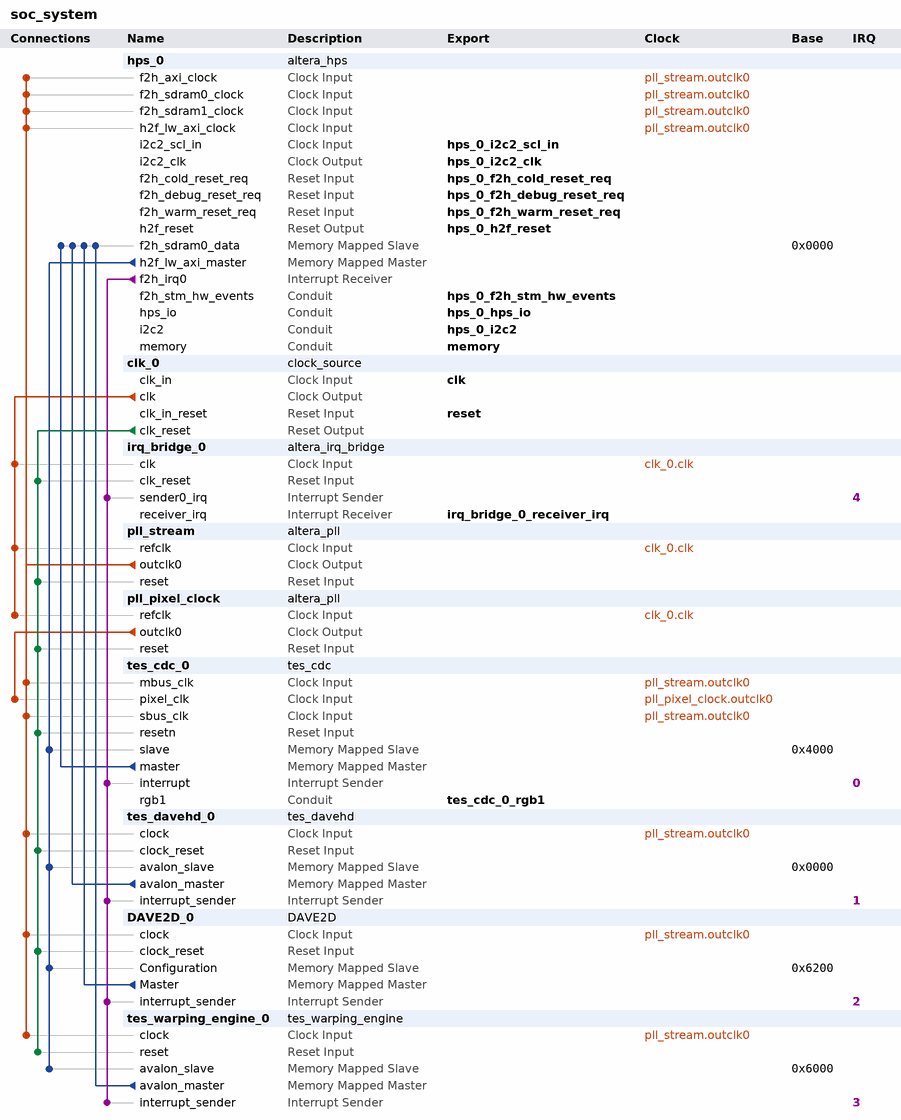
[diagram p0: system contents]
# Platform Designer (Qsys) system soc_system, Cyclone V 5CSXFC6C6U23C6
# Parameters at their usual value, and those the tool derives, are not listed.
package require -exact qsys 19.1
create_system soc_system
set_project_property DEVICE_FAMILY {Cyclone V}
set_project_property DEVICE 5CSXFC6C6U23C6

add_instance hps_0 altera_hps 19.1
set_instance_parameter_value hps_0 EMAC1_Mode RGMII
set_instance_parameter_value hps_0 EMAC1_PinMuxing {HPS I/O Set 0}
set_instance_parameter_value hps_0 F2SCLK_COLDRST_Enable true
set_instance_parameter_value hps_0 F2SCLK_DBGRST_Enable true
set_instance_parameter_value hps_0 F2SCLK_WARMRST_Enable true
set_instance_parameter_value hps_0 F2SDRAM_Type {Avalon-MM Bidirectional,Avalon-MM Bidirectional}
set_instance_parameter_value hps_0 F2SDRAM_Width 128,128
set_instance_parameter_value hps_0 F2SINTERRUPT_Enable true
set_instance_parameter_value hps_0 F2S_Width 3
set_instance_parameter_value hps_0 FPGA_PERIPHERAL_OUTPUT_CLOCK_FREQ_EMAC0_GTX_CLK 100
set_instance_parameter_value hps_0 FPGA_PERIPHERAL_OUTPUT_CLOCK_FREQ_EMAC0_MD_CLK 100.0
set_instance_parameter_value hps_0 FPGA_PERIPHERAL_OUTPUT_CLOCK_FREQ_EMAC1_GTX_CLK 100
set_instance_parameter_value hps_0 FPGA_PERIPHERAL_OUTPUT_CLOCK_FREQ_EMAC1_MD_CLK 100.0
set_instance_parameter_value hps_0 HPS_PROTOCOL DDR3
set_instance_parameter_value hps_0 I2C0_Mode I2C
set_instance_parameter_value hps_0 I2C0_PinMuxing {HPS I/O Set 0}
set_instance_parameter_value hps_0 I2C1_Mode I2C
set_instance_parameter_value hps_0 I2C1_PinMuxing {HPS I/O Set 0}
set_instance_parameter_value hps_0 I2C2_Mode Full
set_instance_parameter_value hps_0 I2C2_PinMuxing FPGA
set_instance_parameter_value hps_0 LWH2F_Enable true
set_instance_parameter_value hps_0 MEM_BANKADDR_WIDTH 3
set_instance_parameter_value hps_0 MEM_CLK_FREQ 400.0
set_instance_parameter_value hps_0 MEM_COL_ADDR_WIDTH 10
set_instance_parameter_value hps_0 MEM_DQ_WIDTH 32
set_instance_parameter_value hps_0 MEM_DRV_STR RZQ/6
set_instance_parameter_value hps_0 MEM_ROW_ADDR_WIDTH 15
set_instance_parameter_value hps_0 MEM_RTT_NOM RZQ/6
set_instance_parameter_value hps_0 MEM_RTT_WR {Dynamic ODT off}
set_instance_parameter_value hps_0 MEM_TCL 7
set_instance_parameter_value hps_0 MEM_TFAW_NS 37.5
set_instance_parameter_value hps_0 MEM_TRAS_NS 35.0
set_instance_parameter_value hps_0 MEM_TRCD_NS 13.75
set_instance_parameter_value hps_0 MEM_TRFC_NS 300.0
set_instance_parameter_value hps_0 MEM_TRP_NS 13.75
set_instance_parameter_value hps_0 MEM_VENDOR Other
set_instance_parameter_value hps_0 MEM_WTCL 7
set_instance_parameter_value hps_0 QSPI_Mode N/A
set_instance_parameter_value hps_0 QSPI_PinMuxing Unused
set_instance_parameter_value hps_0 REF_CLK_FREQ 25.0
set_instance_parameter_value hps_0 S2FCLK_USER2CLK 5
set_instance_parameter_value hps_0 S2F_Width 0
set_instance_parameter_value hps_0 SDIO_Mode {4-bit Data}
set_instance_parameter_value hps_0 SDIO_PinMuxing {HPS I/O Set 0}
set_instance_parameter_value hps_0 SPIM1_Mode {Single Slave Select}
set_instance_parameter_value hps_0 SPIM1_PinMuxing {HPS I/O Set 0}
set_instance_parameter_value hps_0 STM_Enable true
set_instance_parameter_value hps_0 TIMING_BOARD_AC_SKEW 0.02
set_instance_parameter_value hps_0 TIMING_BOARD_AC_TO_CK_SKEW 0.0
set_instance_parameter_value hps_0 TIMING_BOARD_DQ_TO_DQS_SKEW 0.0
set_instance_parameter_value hps_0 TIMING_BOARD_MAX_CK_DELAY 0.6
set_instance_parameter_value hps_0 TIMING_BOARD_MAX_DQS_DELAY 0.6
set_instance_parameter_value hps_0 TIMING_BOARD_SKEW_BETWEEN_DQS 0.02
set_instance_parameter_value hps_0 TIMING_BOARD_SKEW_CKDQS_DIMM_MAX 0.01
set_instance_parameter_value hps_0 TIMING_BOARD_SKEW_CKDQS_DIMM_MIN -0.01
set_instance_parameter_value hps_0 TIMING_BOARD_SKEW_WITHIN_DQS 0.02
set_instance_parameter_value hps_0 TIMING_TDH 125
set_instance_parameter_value hps_0 TIMING_TDQSCK 400
set_instance_parameter_value hps_0 TIMING_TDQSQ 120
set_instance_parameter_value hps_0 TIMING_TDS 50
set_instance_parameter_value hps_0 TIMING_TIH 250
set_instance_parameter_value hps_0 TIMING_TIS 175
set_instance_parameter_value hps_0 TIMING_TQSH 0.38
set_instance_parameter_value hps_0 UART0_Mode {No Flow Control}
set_instance_parameter_value hps_0 UART0_PinMuxing {HPS I/O Set 0}
set_instance_parameter_value hps_0 USB1_Mode SDR
set_instance_parameter_value hps_0 USB1_PinMuxing {HPS I/O Set 0}
set_instance_parameter_value hps_0 desired_cfg_clk_mhz 100.0
set_instance_parameter_value hps_0 desired_qspi_clk_mhz 370.0

add_instance clk_0 clock_source 19.1
set_instance_parameter_value clk_0 clockFrequency 50000000

add_instance irq_bridge_0 altera_irq_bridge 19.1
set_instance_parameter_value irq_bridge_0 IRQ_WIDTH 1

add_instance pll_stream altera_pll 19.1
set_instance_parameter_value pll_stream gui_device_speed_grade 2
set_instance_parameter_value pll_stream gui_number_of_clocks 1
set_instance_parameter_value pll_stream gui_operation_mode direct
set_instance_parameter_value pll_stream gui_output_clock_frequency0 85.0
set_instance_parameter_value pll_stream gui_pll_mode {Integer-N PLL}
set_instance_parameter_value pll_stream gui_reference_clock_frequency 50.0
set_instance_parameter_value pll_stream gui_use_locked true

add_instance pll_pixel_clock altera_pll 19.1
set_instance_parameter_value pll_pixel_clock gui_device_speed_grade 1
set_instance_parameter_value pll_pixel_clock gui_number_of_clocks 1
set_instance_parameter_value pll_pixel_clock gui_operation_mode direct
set_instance_parameter_value pll_pixel_clock gui_output_clock_frequency0 65.0
set_instance_parameter_value pll_pixel_clock gui_pll_mode {Integer-N PLL}
set_instance_parameter_value pll_pixel_clock gui_reference_clock_frequency 50.0
set_instance_parameter_value pll_pixel_clock gui_use_locked true

add_instance tes_cdc_0 tes_cdc 3.0
set_instance_parameter_value tes_cdc_0 BG_BLUE 0
set_instance_parameter_value tes_cdc_0 BG_GREEN 0
set_instance_parameter_value tes_cdc_0 BG_RED 0
set_instance_parameter_value tes_cdc_0 BLUE_WIDTH 8
set_instance_parameter_value tes_cdc_0 C_AUX_FB_FIFO_ADDRESS_WIDTH 9
set_instance_parameter_value tes_cdc_0 C_AXI_ID_ENA true
set_instance_parameter_value tes_cdc_0 C_BACKGROUND_BLENDING_ENA false
set_instance_parameter_value tes_cdc_0 C_BACKGROUND_LAYER_ENA false
set_instance_parameter_value tes_cdc_0 C_BG_COLOR_PROG true
set_instance_parameter_value tes_cdc_0 C_BG_RAM_ADDRESS_WIDTH 9
set_instance_parameter_value tes_cdc_0 C_BG_RAM_ADDR_CALC_FRAC_WIDTH 4
set_instance_parameter_value tes_cdc_0 C_BG_RAM_ADDR_INCR_INT_WIDTH 6
set_instance_parameter_value tes_cdc_0 C_BLANK_POL 0
set_instance_parameter_value tes_cdc_0 C_BLENDING_ORDER_ENA true
set_instance_parameter_value tes_cdc_0 C_BLIND_MODE_ENA false
set_instance_parameter_value tes_cdc_0 C_BURSTCOUNT_WIDTH 4
set_instance_parameter_value tes_cdc_0 C_BUS_ADDRESS_WIDTH 32
set_instance_parameter_value tes_cdc_0 C_BUS_BYTE_SEL_WIDTH 4
set_instance_parameter_value tes_cdc_0 C_BUS_ID_WIDTH 4
set_instance_parameter_value tes_cdc_0 C_COLOR_FB_FIFO_ADDRESS_WIDTH 8
set_instance_parameter_value tes_cdc_0 C_CONFIG_READING_ENA true
set_instance_parameter_value tes_cdc_0 C_CRC_MODE 0
set_instance_parameter_value tes_cdc_0 C_CSC_DATA_WIDTH 32
set_instance_parameter_value tes_cdc_0 C_DITHERING_TECHNIQUE 3
set_instance_parameter_value tes_cdc_0 C_DITHER_WIDTH_BLUE 2
set_instance_parameter_value tes_cdc_0 C_DITHER_WIDTH_GREEN 2
set_instance_parameter_value tes_cdc_0 C_DITHER_WIDTH_PROG false
set_instance_parameter_value tes_cdc_0 C_DITHER_WIDTH_RED 2
set_instance_parameter_value tes_cdc_0 C_DUAL_VIEW_ENA false
set_instance_parameter_value tes_cdc_0 C_EXTEND_BURSTS_TO_NEXT_VALID_BURST false
set_instance_parameter_value tes_cdc_0 C_FB_LINE_LENGTH_WIDTH 13
set_instance_parameter_value tes_cdc_0 C_FB_NUM_LINES_WIDTH 12
set_instance_parameter_value tes_cdc_0 C_GAMMA_CORRECTION_TECHNIQUE 0
set_instance_parameter_value tes_cdc_0 C_HDMI_IP_OUT_ENA false
set_instance_parameter_value tes_cdc_0 C_HDMI_OUT_WIDTH 48
set_instance_parameter_value tes_cdc_0 C_HDMI_SYM_PER_CLK 2
set_instance_parameter_value tes_cdc_0 C_HSYNC_POL 0
set_instance_parameter_value tes_cdc_0 C_IRQ_DEFAULT 0
set_instance_parameter_value tes_cdc_0 C_IRQ_SECONDARY 0
set_instance_parameter_value tes_cdc_0 C_LAYER_ADDRESS_ALIGN_BITS 0
set_instance_parameter_value tes_cdc_0 C_LAYER_COUNT 2
set_instance_parameter_value tes_cdc_0 C_LINE_IRQ_POS_PROG true
set_instance_parameter_value tes_cdc_0 C_MASTER_INTERFACE_TYPE 0
set_instance_parameter_value tes_cdc_0 C_MAX_OUTSTANDING_READS 2
set_instance_parameter_value tes_cdc_0 C_OUTPUT_YCBCR_ENA false
set_instance_parameter_value tes_cdc_0 C_PIXEL_CLK_POL 0
set_instance_parameter_value tes_cdc_0 C_PIXEL_PIPE_FREQ_LEVEL 2
set_instance_parameter_value tes_cdc_0 C_POS_WIDTH 12
set_instance_parameter_value tes_cdc_0 C_PRECISE_BLENDING true
set_instance_parameter_value tes_cdc_0 C_SDI_IP_OUT_ENA false
set_instance_parameter_value tes_cdc_0 C_SDI_OUT_WIDTH 20
set_instance_parameter_value tes_cdc_0 C_SECONDARY_IRQ_ENA true
set_instance_parameter_value tes_cdc_0 C_SECONDARY_PORT_ENA false
set_instance_parameter_value tes_cdc_0 C_SHADOW_REGS_ENA true
set_instance_parameter_value tes_cdc_0 C_SINGLE_FRAME_ENA false
set_instance_parameter_value tes_cdc_0 C_SLAVE_INTERFACE_TYPE 1
set_instance_parameter_value tes_cdc_0 C_SLAVE_TIMING_ENA false
set_instance_parameter_value tes_cdc_0 C_STATUS_REGS_ENA true
set_instance_parameter_value tes_cdc_0 C_SYNC_POL_PROG true
set_instance_parameter_value tes_cdc_0 C_TIMING_PROG true
set_instance_parameter_value tes_cdc_0 C_UNALIGNED_LOOK_AHEAD_BYTES 0
set_instance_parameter_value tes_cdc_0 C_UNDERRUN_TRACKING false
set_instance_parameter_value tes_cdc_0 C_VSYNC_POL 0
set_instance_parameter_value tes_cdc_0 C_WRITE_BUS_FIFO_ADDRESS_WIDTH 6
set_instance_parameter_value tes_cdc_0 C_WRITE_BUS_FIFO_DATA_WIDTH 128
set_instance_parameter_value tes_cdc_0 GREEN_WIDTH 8
set_instance_parameter_value tes_cdc_0 H_ACTIVE_CUSTOM 640
set_instance_parameter_value tes_cdc_0 H_B_PORCH_CUSTOM 48
set_instance_parameter_value tes_cdc_0 H_F_PORCH_CUSTOM 16
set_instance_parameter_value tes_cdc_0 H_SYNC_WIDTH_CUSTOM 96
set_instance_parameter_value tes_cdc_0 RED_WIDTH 8
set_instance_parameter_value tes_cdc_0 SELECTED_CONFIGURATION_1 Default
set_instance_parameter_value tes_cdc_0 SELECTED_CONFIGURATION_10 Default
set_instance_parameter_value tes_cdc_0 SELECTED_CONFIGURATION_2 Default
set_instance_parameter_value tes_cdc_0 SELECTED_CONFIGURATION_3 Default
set_instance_parameter_value tes_cdc_0 SELECTED_CONFIGURATION_4 Default
set_instance_parameter_value tes_cdc_0 SELECTED_CONFIGURATION_5 Default
set_instance_parameter_value tes_cdc_0 SELECTED_CONFIGURATION_6 Default
set_instance_parameter_value tes_cdc_0 SELECTED_CONFIGURATION_7 Default
set_instance_parameter_value tes_cdc_0 SELECTED_CONFIGURATION_8 Default
set_instance_parameter_value tes_cdc_0 SELECTED_CONFIGURATION_9 Default
set_instance_parameter_value tes_cdc_0 SELECTED_VIDEO_MODE {1024x768@60Hz}
set_instance_parameter_value tes_cdc_0 SHOW_TIMING_GRAPH false
set_instance_parameter_value tes_cdc_0 V_ACTIVE_CUSTOM 480
set_instance_parameter_value tes_cdc_0 V_B_PORCH_CUSTOM 33
set_instance_parameter_value tes_cdc_0 V_F_PORCH_CUSTOM 10
set_instance_parameter_value tes_cdc_0 V_SYNC_HEIGHT_CUSTOM 2
set_instance_parameter_value tes_cdc_0 alpha_plane_ena_cust_1 false
set_instance_parameter_value tes_cdc_0 alpha_plane_ena_cust_10 false
set_instance_parameter_value tes_cdc_0 alpha_plane_ena_cust_2 false
set_instance_parameter_value tes_cdc_0 alpha_plane_ena_cust_3 false
set_instance_parameter_value tes_cdc_0 alpha_plane_ena_cust_4 false
set_instance_parameter_value tes_cdc_0 alpha_plane_ena_cust_5 false
set_instance_parameter_value tes_cdc_0 alpha_plane_ena_cust_6 false
set_instance_parameter_value tes_cdc_0 alpha_plane_ena_cust_7 false
set_instance_parameter_value tes_cdc_0 alpha_plane_ena_cust_8 false
set_instance_parameter_value tes_cdc_0 alpha_plane_ena_cust_9 false
set_instance_parameter_value tes_cdc_0 aux_fb_dupl_ena_cust_1 false
set_instance_parameter_value tes_cdc_0 aux_fb_dupl_ena_cust_10 false
set_instance_parameter_value tes_cdc_0 aux_fb_dupl_ena_cust_2 false
set_instance_parameter_value tes_cdc_0 aux_fb_dupl_ena_cust_3 false
set_instance_parameter_value tes_cdc_0 aux_fb_dupl_ena_cust_4 false
set_instance_parameter_value tes_cdc_0 aux_fb_dupl_ena_cust_5 false
set_instance_parameter_value tes_cdc_0 aux_fb_dupl_ena_cust_6 false
set_instance_parameter_value tes_cdc_0 aux_fb_dupl_ena_cust_7 false
set_instance_parameter_value tes_cdc_0 aux_fb_dupl_ena_cust_8 false
set_instance_parameter_value tes_cdc_0 aux_fb_dupl_ena_cust_9 false
set_instance_parameter_value tes_cdc_0 aux_fb_pitch_ena_cust_1 false
set_instance_parameter_value tes_cdc_0 aux_fb_pitch_ena_cust_10 false
set_instance_parameter_value tes_cdc_0 aux_fb_pitch_ena_cust_2 false
set_instance_parameter_value tes_cdc_0 aux_fb_pitch_ena_cust_3 false
set_instance_parameter_value tes_cdc_0 aux_fb_pitch_ena_cust_4 false
set_instance_parameter_value tes_cdc_0 aux_fb_pitch_ena_cust_5 false
set_instance_parameter_value tes_cdc_0 aux_fb_pitch_ena_cust_6 false
set_instance_parameter_value tes_cdc_0 aux_fb_pitch_ena_cust_7 false
set_instance_parameter_value tes_cdc_0 aux_fb_pitch_ena_cust_8 false
set_instance_parameter_value tes_cdc_0 aux_fb_pitch_ena_cust_9 false
set_instance_parameter_value tes_cdc_0 clut_ena_cust_1 true
set_instance_parameter_value tes_cdc_0 clut_ena_cust_10 true
set_instance_parameter_value tes_cdc_0 clut_ena_cust_2 true
set_instance_parameter_value tes_cdc_0 clut_ena_cust_3 true
set_instance_parameter_value tes_cdc_0 clut_ena_cust_4 true
set_instance_parameter_value tes_cdc_0 clut_ena_cust_5 true
set_instance_parameter_value tes_cdc_0 clut_ena_cust_6 true
set_instance_parameter_value tes_cdc_0 clut_ena_cust_7 true
set_instance_parameter_value tes_cdc_0 clut_ena_cust_8 true
set_instance_parameter_value tes_cdc_0 clut_ena_cust_9 true
set_instance_parameter_value tes_cdc_0 color_fb_dupl_ena_cust_1 false
set_instance_parameter_value tes_cdc_0 color_fb_dupl_ena_cust_10 false
set_instance_parameter_value tes_cdc_0 color_fb_dupl_ena_cust_2 false
set_instance_parameter_value tes_cdc_0 color_fb_dupl_ena_cust_3 false
set_instance_parameter_value tes_cdc_0 color_fb_dupl_ena_cust_4 false
set_instance_parameter_value tes_cdc_0 color_fb_dupl_ena_cust_5 false
set_instance_parameter_value tes_cdc_0 color_fb_dupl_ena_cust_6 false
set_instance_parameter_value tes_cdc_0 color_fb_dupl_ena_cust_7 false
set_instance_parameter_value tes_cdc_0 color_fb_dupl_ena_cust_8 false
set_instance_parameter_value tes_cdc_0 color_fb_dupl_ena_cust_9 false
set_instance_parameter_value tes_cdc_0 color_fb_pitch_ena_cust_1 true
set_instance_parameter_value tes_cdc_0 color_fb_pitch_ena_cust_10 true
set_instance_parameter_value tes_cdc_0 color_fb_pitch_ena_cust_2 true
set_instance_parameter_value tes_cdc_0 color_fb_pitch_ena_cust_3 true
set_instance_parameter_value tes_cdc_0 color_fb_pitch_ena_cust_4 true
set_instance_parameter_value tes_cdc_0 color_fb_pitch_ena_cust_5 true
set_instance_parameter_value tes_cdc_0 color_fb_pitch_ena_cust_6 true
set_instance_parameter_value tes_cdc_0 color_fb_pitch_ena_cust_7 true
set_instance_parameter_value tes_cdc_0 color_fb_pitch_ena_cust_8 true
set_instance_parameter_value tes_cdc_0 color_fb_pitch_ena_cust_9 true
set_instance_parameter_value tes_cdc_0 color_key_blue_cust_1 0
set_instance_parameter_value tes_cdc_0 color_key_blue_cust_10 0
set_instance_parameter_value tes_cdc_0 color_key_blue_cust_2 0
set_instance_parameter_value tes_cdc_0 color_key_blue_cust_3 0
set_instance_parameter_value tes_cdc_0 color_key_blue_cust_4 0
set_instance_parameter_value tes_cdc_0 color_key_blue_cust_5 0
set_instance_parameter_value tes_cdc_0 color_key_blue_cust_6 0
set_instance_parameter_value tes_cdc_0 color_key_blue_cust_7 0
set_instance_parameter_value tes_cdc_0 color_key_blue_cust_8 0
set_instance_parameter_value tes_cdc_0 color_key_blue_cust_9 0
set_instance_parameter_value tes_cdc_0 color_key_ena_cust_1 true
set_instance_parameter_value tes_cdc_0 color_key_ena_cust_10 true
set_instance_parameter_value tes_cdc_0 color_key_ena_cust_2 true
set_instance_parameter_value tes_cdc_0 color_key_ena_cust_3 true
set_instance_parameter_value tes_cdc_0 color_key_ena_cust_4 true
set_instance_parameter_value tes_cdc_0 color_key_ena_cust_5 true
set_instance_parameter_value tes_cdc_0 color_key_ena_cust_6 true
set_instance_parameter_value tes_cdc_0 color_key_ena_cust_7 true
set_instance_parameter_value tes_cdc_0 color_key_ena_cust_8 true
set_instance_parameter_value tes_cdc_0 color_key_ena_cust_9 true
set_instance_parameter_value tes_cdc_0 color_key_green_cust_1 0
set_instance_parameter_value tes_cdc_0 color_key_green_cust_10 0
set_instance_parameter_value tes_cdc_0 color_key_green_cust_2 0
set_instance_parameter_value tes_cdc_0 color_key_green_cust_3 0
set_instance_parameter_value tes_cdc_0 color_key_green_cust_4 0
set_instance_parameter_value tes_cdc_0 color_key_green_cust_5 0
set_instance_parameter_value tes_cdc_0 color_key_green_cust_6 0
set_instance_parameter_value tes_cdc_0 color_key_green_cust_7 0
set_instance_parameter_value tes_cdc_0 color_key_green_cust_8 0
set_instance_parameter_value tes_cdc_0 color_key_green_cust_9 0
set_instance_parameter_value tes_cdc_0 color_key_red_cust_1 0
set_instance_parameter_value tes_cdc_0 color_key_red_cust_10 0
set_instance_parameter_value tes_cdc_0 color_key_red_cust_2 0
set_instance_parameter_value tes_cdc_0 color_key_red_cust_3 0
set_instance_parameter_value tes_cdc_0 color_key_red_cust_4 0
set_instance_parameter_value tes_cdc_0 color_key_red_cust_5 0
set_instance_parameter_value tes_cdc_0 color_key_red_cust_6 0
set_instance_parameter_value tes_cdc_0 color_key_red_cust_7 0
set_instance_parameter_value tes_cdc_0 color_key_red_cust_8 0
set_instance_parameter_value tes_cdc_0 color_key_red_cust_9 0
set_instance_parameter_value tes_cdc_0 color_key_repl_ena_cust_1 false
set_instance_parameter_value tes_cdc_0 color_key_repl_ena_cust_10 false
set_instance_parameter_value tes_cdc_0 color_key_repl_ena_cust_2 false
set_instance_parameter_value tes_cdc_0 color_key_repl_ena_cust_3 false
set_instance_parameter_value tes_cdc_0 color_key_repl_ena_cust_4 false
set_instance_parameter_value tes_cdc_0 color_key_repl_ena_cust_5 false
set_instance_parameter_value tes_cdc_0 color_key_repl_ena_cust_6 false
set_instance_parameter_value tes_cdc_0 color_key_repl_ena_cust_7 false
set_instance_parameter_value tes_cdc_0 color_key_repl_ena_cust_8 false
set_instance_parameter_value tes_cdc_0 color_key_repl_ena_cust_9 false
set_instance_parameter_value tes_cdc_0 const_alpha_cust_1 0
set_instance_parameter_value tes_cdc_0 const_alpha_cust_10 0
set_instance_parameter_value tes_cdc_0 const_alpha_cust_2 0
set_instance_parameter_value tes_cdc_0 const_alpha_cust_3 0
set_instance_parameter_value tes_cdc_0 const_alpha_cust_4 0
set_instance_parameter_value tes_cdc_0 const_alpha_cust_5 0
set_instance_parameter_value tes_cdc_0 const_alpha_cust_6 0
set_instance_parameter_value tes_cdc_0 const_alpha_cust_7 0
set_instance_parameter_value tes_cdc_0 const_alpha_cust_8 0
set_instance_parameter_value tes_cdc_0 const_alpha_cust_9 0
set_instance_parameter_value tes_cdc_0 default_color_prog_cust_1 false
set_instance_parameter_value tes_cdc_0 default_color_prog_cust_10 false
set_instance_parameter_value tes_cdc_0 default_color_prog_cust_2 false
set_instance_parameter_value tes_cdc_0 default_color_prog_cust_3 false
set_instance_parameter_value tes_cdc_0 default_color_prog_cust_4 false
set_instance_parameter_value tes_cdc_0 default_color_prog_cust_5 false
set_instance_parameter_value tes_cdc_0 default_color_prog_cust_6 false
set_instance_parameter_value tes_cdc_0 default_color_prog_cust_7 false
set_instance_parameter_value tes_cdc_0 default_color_prog_cust_8 false
set_instance_parameter_value tes_cdc_0 default_color_prog_cust_9 false
set_instance_parameter_value tes_cdc_0 default_colour_alpha_cust_1 0
set_instance_parameter_value tes_cdc_0 default_colour_alpha_cust_10 0
set_instance_parameter_value tes_cdc_0 default_colour_alpha_cust_2 0
set_instance_parameter_value tes_cdc_0 default_colour_alpha_cust_3 0
set_instance_parameter_value tes_cdc_0 default_colour_alpha_cust_4 0
set_instance_parameter_value tes_cdc_0 default_colour_alpha_cust_5 0
set_instance_parameter_value tes_cdc_0 default_colour_alpha_cust_6 0
set_instance_parameter_value tes_cdc_0 default_colour_alpha_cust_7 0
set_instance_parameter_value tes_cdc_0 default_colour_alpha_cust_8 0
set_instance_parameter_value tes_cdc_0 default_colour_alpha_cust_9 0
set_instance_parameter_value tes_cdc_0 default_colour_blue_cust_1 0
set_instance_parameter_value tes_cdc_0 default_colour_blue_cust_10 0
set_instance_parameter_value tes_cdc_0 default_colour_blue_cust_2 0
set_instance_parameter_value tes_cdc_0 default_colour_blue_cust_3 0
set_instance_parameter_value tes_cdc_0 default_colour_blue_cust_4 0
set_instance_parameter_value tes_cdc_0 default_colour_blue_cust_5 0
set_instance_parameter_value tes_cdc_0 default_colour_blue_cust_6 0
set_instance_parameter_value tes_cdc_0 default_colour_blue_cust_7 0
set_instance_parameter_value tes_cdc_0 default_colour_blue_cust_8 0
set_instance_parameter_value tes_cdc_0 default_colour_blue_cust_9 0
set_instance_parameter_value tes_cdc_0 default_colour_green_cust_1 0
set_instance_parameter_value tes_cdc_0 default_colour_green_cust_10 0
set_instance_parameter_value tes_cdc_0 default_colour_green_cust_2 0
set_instance_parameter_value tes_cdc_0 default_colour_green_cust_3 0
set_instance_parameter_value tes_cdc_0 default_colour_green_cust_4 0
set_instance_parameter_value tes_cdc_0 default_colour_green_cust_5 0
set_instance_parameter_value tes_cdc_0 default_colour_green_cust_6 0
set_instance_parameter_value tes_cdc_0 default_colour_green_cust_7 0
set_instance_parameter_value tes_cdc_0 default_colour_green_cust_8 0
set_instance_parameter_value tes_cdc_0 default_colour_green_cust_9 0
set_instance_parameter_value tes_cdc_0 default_colour_red_cust_1 0
set_instance_parameter_value tes_cdc_0 default_colour_red_cust_10 0
set_instance_parameter_value tes_cdc_0 default_colour_red_cust_2 0
set_instance_parameter_value tes_cdc_0 default_colour_red_cust_3 0
set_instance_parameter_value tes_cdc_0 default_colour_red_cust_4 0
set_instance_parameter_value tes_cdc_0 default_colour_red_cust_5 0
set_instance_parameter_value tes_cdc_0 default_colour_red_cust_6 0
set_instance_parameter_value tes_cdc_0 default_colour_red_cust_7 0
set_instance_parameter_value tes_cdc_0 default_colour_red_cust_8 0
set_instance_parameter_value tes_cdc_0 default_colour_red_cust_9 0
set_instance_parameter_value tes_cdc_0 f1_blend_alpha_mul_const_alpha_cust_1 true
set_instance_parameter_value tes_cdc_0 f1_blend_alpha_mul_const_alpha_cust_10 true
set_instance_parameter_value tes_cdc_0 f1_blend_alpha_mul_const_alpha_cust_2 true
set_instance_parameter_value tes_cdc_0 f1_blend_alpha_mul_const_alpha_cust_3 true
set_instance_parameter_value tes_cdc_0 f1_blend_alpha_mul_const_alpha_cust_4 true
set_instance_parameter_value tes_cdc_0 f1_blend_alpha_mul_const_alpha_cust_5 true
set_instance_parameter_value tes_cdc_0 f1_blend_alpha_mul_const_alpha_cust_6 true
set_instance_parameter_value tes_cdc_0 f1_blend_alpha_mul_const_alpha_cust_7 true
set_instance_parameter_value tes_cdc_0 f1_blend_alpha_mul_const_alpha_cust_8 true
set_instance_parameter_value tes_cdc_0 f1_blend_alpha_mul_const_alpha_cust_9 true
set_instance_parameter_value tes_cdc_0 f1_blend_app_cust_1 false
set_instance_parameter_value tes_cdc_0 f1_blend_app_cust_10 false
set_instance_parameter_value tes_cdc_0 f1_blend_app_cust_2 false
set_instance_parameter_value tes_cdc_0 f1_blend_app_cust_3 false
set_instance_parameter_value tes_cdc_0 f1_blend_app_cust_4 false
set_instance_parameter_value tes_cdc_0 f1_blend_app_cust_5 false
set_instance_parameter_value tes_cdc_0 f1_blend_app_cust_6 false
set_instance_parameter_value tes_cdc_0 f1_blend_app_cust_7 false
set_instance_parameter_value tes_cdc_0 f1_blend_app_cust_8 false
set_instance_parameter_value tes_cdc_0 f1_blend_app_cust_9 false
set_instance_parameter_value tes_cdc_0 f1_blend_const_alpha_cust_1 true
set_instance_parameter_value tes_cdc_0 f1_blend_const_alpha_cust_10 true
set_instance_parameter_value tes_cdc_0 f1_blend_const_alpha_cust_2 true
set_instance_parameter_value tes_cdc_0 f1_blend_const_alpha_cust_3 true
set_instance_parameter_value tes_cdc_0 f1_blend_const_alpha_cust_4 true
set_instance_parameter_value tes_cdc_0 f1_blend_const_alpha_cust_5 true
set_instance_parameter_value tes_cdc_0 f1_blend_const_alpha_cust_6 true
set_instance_parameter_value tes_cdc_0 f1_blend_const_alpha_cust_7 true
set_instance_parameter_value tes_cdc_0 f1_blend_const_alpha_cust_8 true
set_instance_parameter_value tes_cdc_0 f1_blend_const_alpha_cust_9 true
set_instance_parameter_value tes_cdc_0 f1_blend_factor_default_cust_1 6
set_instance_parameter_value tes_cdc_0 f1_blend_factor_default_cust_10 6
set_instance_parameter_value tes_cdc_0 f1_blend_factor_default_cust_2 6
set_instance_parameter_value tes_cdc_0 f1_blend_factor_default_cust_3 6
set_instance_parameter_value tes_cdc_0 f1_blend_factor_default_cust_4 6
set_instance_parameter_value tes_cdc_0 f1_blend_factor_default_cust_5 6
set_instance_parameter_value tes_cdc_0 f1_blend_factor_default_cust_6 6
set_instance_parameter_value tes_cdc_0 f1_blend_factor_default_cust_7 6
set_instance_parameter_value tes_cdc_0 f1_blend_factor_default_cust_8 6
set_instance_parameter_value tes_cdc_0 f1_blend_factor_default_cust_9 6
set_instance_parameter_value tes_cdc_0 f1_blend_inv_alpha_mul_const_alpha_cust_1 false
set_instance_parameter_value tes_cdc_0 f1_blend_inv_alpha_mul_const_alpha_cust_10 false
set_instance_parameter_value tes_cdc_0 f1_blend_inv_alpha_mul_const_alpha_cust_2 false
set_instance_parameter_value tes_cdc_0 f1_blend_inv_alpha_mul_const_alpha_cust_3 false
set_instance_parameter_value tes_cdc_0 f1_blend_inv_alpha_mul_const_alpha_cust_4 false
set_instance_parameter_value tes_cdc_0 f1_blend_inv_alpha_mul_const_alpha_cust_5 false
set_instance_parameter_value tes_cdc_0 f1_blend_inv_alpha_mul_const_alpha_cust_6 false
set_instance_parameter_value tes_cdc_0 f1_blend_inv_alpha_mul_const_alpha_cust_7 false
set_instance_parameter_value tes_cdc_0 f1_blend_inv_alpha_mul_const_alpha_cust_8 false
set_instance_parameter_value tes_cdc_0 f1_blend_inv_alpha_mul_const_alpha_cust_9 false
set_instance_parameter_value tes_cdc_0 f1_blend_inv_app_cust_1 false
set_instance_parameter_value tes_cdc_0 f1_blend_inv_app_cust_10 false
set_instance_parameter_value tes_cdc_0 f1_blend_inv_app_cust_2 false
set_instance_parameter_value tes_cdc_0 f1_blend_inv_app_cust_3 false
set_instance_parameter_value tes_cdc_0 f1_blend_inv_app_cust_4 false
set_instance_parameter_value tes_cdc_0 f1_blend_inv_app_cust_5 false
set_instance_parameter_value tes_cdc_0 f1_blend_inv_app_cust_6 false
set_instance_parameter_value tes_cdc_0 f1_blend_inv_app_cust_7 false
set_instance_parameter_value tes_cdc_0 f1_blend_inv_app_cust_8 false
set_instance_parameter_value tes_cdc_0 f1_blend_inv_app_cust_9 false
set_instance_parameter_value tes_cdc_0 f1_blend_inv_const_alpha_cust_1 false
set_instance_parameter_value tes_cdc_0 f1_blend_inv_const_alpha_cust_10 false
set_instance_parameter_value tes_cdc_0 f1_blend_inv_const_alpha_cust_2 false
set_instance_parameter_value tes_cdc_0 f1_blend_inv_const_alpha_cust_3 false
set_instance_parameter_value tes_cdc_0 f1_blend_inv_const_alpha_cust_4 false
set_instance_parameter_value tes_cdc_0 f1_blend_inv_const_alpha_cust_5 false
set_instance_parameter_value tes_cdc_0 f1_blend_inv_const_alpha_cust_6 false
set_instance_parameter_value tes_cdc_0 f1_blend_inv_const_alpha_cust_7 false
set_instance_parameter_value tes_cdc_0 f1_blend_inv_const_alpha_cust_8 false
set_instance_parameter_value tes_cdc_0 f1_blend_inv_const_alpha_cust_9 false
set_instance_parameter_value tes_cdc_0 f1_blend_one_cust_1 false
set_instance_parameter_value tes_cdc_0 f1_blend_one_cust_10 false
set_instance_parameter_value tes_cdc_0 f1_blend_one_cust_2 false
set_instance_parameter_value tes_cdc_0 f1_blend_one_cust_3 false
set_instance_parameter_value tes_cdc_0 f1_blend_one_cust_4 false
set_instance_parameter_value tes_cdc_0 f1_blend_one_cust_5 false
set_instance_parameter_value tes_cdc_0 f1_blend_one_cust_6 false
set_instance_parameter_value tes_cdc_0 f1_blend_one_cust_7 false
set_instance_parameter_value tes_cdc_0 f1_blend_one_cust_8 false
set_instance_parameter_value tes_cdc_0 f1_blend_one_cust_9 false
set_instance_parameter_value tes_cdc_0 f1_blend_zero_cust_1 false
set_instance_parameter_value tes_cdc_0 f1_blend_zero_cust_10 false
set_instance_parameter_value tes_cdc_0 f1_blend_zero_cust_2 false
set_instance_parameter_value tes_cdc_0 f1_blend_zero_cust_3 false
set_instance_parameter_value tes_cdc_0 f1_blend_zero_cust_4 false
set_instance_parameter_value tes_cdc_0 f1_blend_zero_cust_5 false
set_instance_parameter_value tes_cdc_0 f1_blend_zero_cust_6 false
set_instance_parameter_value tes_cdc_0 f1_blend_zero_cust_7 false
set_instance_parameter_value tes_cdc_0 f1_blend_zero_cust_8 false
set_instance_parameter_value tes_cdc_0 f1_blend_zero_cust_9 false
set_instance_parameter_value tes_cdc_0 f2_blend_alpha_mul_const_alpha_cust_1 false
set_instance_parameter_value tes_cdc_0 f2_blend_alpha_mul_const_alpha_cust_10 false
set_instance_parameter_value tes_cdc_0 f2_blend_alpha_mul_const_alpha_cust_2 false
set_instance_parameter_value tes_cdc_0 f2_blend_alpha_mul_const_alpha_cust_3 false
set_instance_parameter_value tes_cdc_0 f2_blend_alpha_mul_const_alpha_cust_4 false
set_instance_parameter_value tes_cdc_0 f2_blend_alpha_mul_const_alpha_cust_5 false
set_instance_parameter_value tes_cdc_0 f2_blend_alpha_mul_const_alpha_cust_6 false
set_instance_parameter_value tes_cdc_0 f2_blend_alpha_mul_const_alpha_cust_7 false
set_instance_parameter_value tes_cdc_0 f2_blend_alpha_mul_const_alpha_cust_8 false
set_instance_parameter_value tes_cdc_0 f2_blend_alpha_mul_const_alpha_cust_9 false
set_instance_parameter_value tes_cdc_0 f2_blend_app_cust_1 false
set_instance_parameter_value tes_cdc_0 f2_blend_app_cust_10 false
set_instance_parameter_value tes_cdc_0 f2_blend_app_cust_2 false
set_instance_parameter_value tes_cdc_0 f2_blend_app_cust_3 false
set_instance_parameter_value tes_cdc_0 f2_blend_app_cust_4 false
set_instance_parameter_value tes_cdc_0 f2_blend_app_cust_5 false
set_instance_parameter_value tes_cdc_0 f2_blend_app_cust_6 false
set_instance_parameter_value tes_cdc_0 f2_blend_app_cust_7 false
set_instance_parameter_value tes_cdc_0 f2_blend_app_cust_8 false
set_instance_parameter_value tes_cdc_0 f2_blend_app_cust_9 false
set_instance_parameter_value tes_cdc_0 f2_blend_const_alpha_cust_1 false
set_instance_parameter_value tes_cdc_0 f2_blend_const_alpha_cust_10 false
set_instance_parameter_value tes_cdc_0 f2_blend_const_alpha_cust_2 false
set_instance_parameter_value tes_cdc_0 f2_blend_const_alpha_cust_3 false
set_instance_parameter_value tes_cdc_0 f2_blend_const_alpha_cust_4 false
set_instance_parameter_value tes_cdc_0 f2_blend_const_alpha_cust_5 false
set_instance_parameter_value tes_cdc_0 f2_blend_const_alpha_cust_6 false
set_instance_parameter_value tes_cdc_0 f2_blend_const_alpha_cust_7 false
set_instance_parameter_value tes_cdc_0 f2_blend_const_alpha_cust_8 false
set_instance_parameter_value tes_cdc_0 f2_blend_const_alpha_cust_9 false
set_instance_parameter_value tes_cdc_0 f2_blend_factor_default_cust_1 7
set_instance_parameter_value tes_cdc_0 f2_blend_factor_default_cust_10 7
set_instance_parameter_value tes_cdc_0 f2_blend_factor_default_cust_2 7
set_instance_parameter_value tes_cdc_0 f2_blend_factor_default_cust_3 7
set_instance_parameter_value tes_cdc_0 f2_blend_factor_default_cust_4 7
set_instance_parameter_value tes_cdc_0 f2_blend_factor_default_cust_5 7
set_instance_parameter_value tes_cdc_0 f2_blend_factor_default_cust_6 7
set_instance_parameter_value tes_cdc_0 f2_blend_factor_default_cust_7 7
set_instance_parameter_value tes_cdc_0 f2_blend_factor_default_cust_8 7
set_instance_parameter_value tes_cdc_0 f2_blend_factor_default_cust_9 7
set_instance_parameter_value tes_cdc_0 f2_blend_inv_alpha_mul_const_alpha_cust_1 true
set_instance_parameter_value tes_cdc_0 f2_blend_inv_alpha_mul_const_alpha_cust_10 true
set_instance_parameter_value tes_cdc_0 f2_blend_inv_alpha_mul_const_alpha_cust_2 true
set_instance_parameter_value tes_cdc_0 f2_blend_inv_alpha_mul_const_alpha_cust_3 true
set_instance_parameter_value tes_cdc_0 f2_blend_inv_alpha_mul_const_alpha_cust_4 true
set_instance_parameter_value tes_cdc_0 f2_blend_inv_alpha_mul_const_alpha_cust_5 true
set_instance_parameter_value tes_cdc_0 f2_blend_inv_alpha_mul_const_alpha_cust_6 true
set_instance_parameter_value tes_cdc_0 f2_blend_inv_alpha_mul_const_alpha_cust_7 true
set_instance_parameter_value tes_cdc_0 f2_blend_inv_alpha_mul_const_alpha_cust_8 true
set_instance_parameter_value tes_cdc_0 f2_blend_inv_alpha_mul_const_alpha_cust_9 true
set_instance_parameter_value tes_cdc_0 f2_blend_inv_app_cust_1 false
set_instance_parameter_value tes_cdc_0 f2_blend_inv_app_cust_10 false
set_instance_parameter_value tes_cdc_0 f2_blend_inv_app_cust_2 false
set_instance_parameter_value tes_cdc_0 f2_blend_inv_app_cust_3 false
set_instance_parameter_value tes_cdc_0 f2_blend_inv_app_cust_4 false
set_instance_parameter_value tes_cdc_0 f2_blend_inv_app_cust_5 false
set_instance_parameter_value tes_cdc_0 f2_blend_inv_app_cust_6 false
set_instance_parameter_value tes_cdc_0 f2_blend_inv_app_cust_7 false
set_instance_parameter_value tes_cdc_0 f2_blend_inv_app_cust_8 false
set_instance_parameter_value tes_cdc_0 f2_blend_inv_app_cust_9 false
set_instance_parameter_value tes_cdc_0 f2_blend_inv_const_alpha_cust_1 true
set_instance_parameter_value tes_cdc_0 f2_blend_inv_const_alpha_cust_10 true
set_instance_parameter_value tes_cdc_0 f2_blend_inv_const_alpha_cust_2 true
set_instance_parameter_value tes_cdc_0 f2_blend_inv_const_alpha_cust_3 true
set_instance_parameter_value tes_cdc_0 f2_blend_inv_const_alpha_cust_4 true
set_instance_parameter_value tes_cdc_0 f2_blend_inv_const_alpha_cust_5 true
set_instance_parameter_value tes_cdc_0 f2_blend_inv_const_alpha_cust_6 true
set_instance_parameter_value tes_cdc_0 f2_blend_inv_const_alpha_cust_7 true
set_instance_parameter_value tes_cdc_0 f2_blend_inv_const_alpha_cust_8 true
set_instance_parameter_value tes_cdc_0 f2_blend_inv_const_alpha_cust_9 true
set_instance_parameter_value tes_cdc_0 f2_blend_one_cust_1 false
set_instance_parameter_value tes_cdc_0 f2_blend_one_cust_10 false
set_instance_parameter_value tes_cdc_0 f2_blend_one_cust_2 false
set_instance_parameter_value tes_cdc_0 f2_blend_one_cust_3 false
set_instance_parameter_value tes_cdc_0 f2_blend_one_cust_4 false
set_instance_parameter_value tes_cdc_0 f2_blend_one_cust_5 false
set_instance_parameter_value tes_cdc_0 f2_blend_one_cust_6 false
set_instance_parameter_value tes_cdc_0 f2_blend_one_cust_7 false
set_instance_parameter_value tes_cdc_0 f2_blend_one_cust_8 false
set_instance_parameter_value tes_cdc_0 f2_blend_one_cust_9 false
set_instance_parameter_value tes_cdc_0 f2_blend_zero_cust_1 false
set_instance_parameter_value tes_cdc_0 f2_blend_zero_cust_10 false
set_instance_parameter_value tes_cdc_0 f2_blend_zero_cust_2 false
set_instance_parameter_value tes_cdc_0 f2_blend_zero_cust_3 false
set_instance_parameter_value tes_cdc_0 f2_blend_zero_cust_4 false
set_instance_parameter_value tes_cdc_0 f2_blend_zero_cust_5 false
set_instance_parameter_value tes_cdc_0 f2_blend_zero_cust_6 false
set_instance_parameter_value tes_cdc_0 f2_blend_zero_cust_7 false
set_instance_parameter_value tes_cdc_0 f2_blend_zero_cust_8 false
set_instance_parameter_value tes_cdc_0 f2_blend_zero_cust_9 false
set_instance_parameter_value tes_cdc_0 format_0_cust_1 1
set_instance_parameter_value tes_cdc_0 format_0_cust_10 1
set_instance_parameter_value tes_cdc_0 format_0_cust_2 1
set_instance_parameter_value tes_cdc_0 format_0_cust_3 1
set_instance_parameter_value tes_cdc_0 format_0_cust_4 1
set_instance_parameter_value tes_cdc_0 format_0_cust_5 1
set_instance_parameter_value tes_cdc_0 format_0_cust_6 1
set_instance_parameter_value tes_cdc_0 format_0_cust_7 1
set_instance_parameter_value tes_cdc_0 format_0_cust_8 1
set_instance_parameter_value tes_cdc_0 format_0_cust_9 1
set_instance_parameter_value tes_cdc_0 format_1_cust_1 0
set_instance_parameter_value tes_cdc_0 format_1_cust_10 1
set_instance_parameter_value tes_cdc_0 format_1_cust_2 1
set_instance_parameter_value tes_cdc_0 format_1_cust_3 1
set_instance_parameter_value tes_cdc_0 format_1_cust_4 1
set_instance_parameter_value tes_cdc_0 format_1_cust_5 1
set_instance_parameter_value tes_cdc_0 format_1_cust_6 1
set_instance_parameter_value tes_cdc_0 format_1_cust_7 1
set_instance_parameter_value tes_cdc_0 format_1_cust_8 1
set_instance_parameter_value tes_cdc_0 format_1_cust_9 1
set_instance_parameter_value tes_cdc_0 format_2_cust_1 0
set_instance_parameter_value tes_cdc_0 format_2_cust_10 1
set_instance_parameter_value tes_cdc_0 format_2_cust_2 1
set_instance_parameter_value tes_cdc_0 format_2_cust_3 1
set_instance_parameter_value tes_cdc_0 format_2_cust_4 1
set_instance_parameter_value tes_cdc_0 format_2_cust_5 1
set_instance_parameter_value tes_cdc_0 format_2_cust_6 1
set_instance_parameter_value tes_cdc_0 format_2_cust_7 1
set_instance_parameter_value tes_cdc_0 format_2_cust_8 1
set_instance_parameter_value tes_cdc_0 format_2_cust_9 1
set_instance_parameter_value tes_cdc_0 format_3_cust_1 0
set_instance_parameter_value tes_cdc_0 format_3_cust_10 1
set_instance_parameter_value tes_cdc_0 format_3_cust_2 1
set_instance_parameter_value tes_cdc_0 format_3_cust_3 1
set_instance_parameter_value tes_cdc_0 format_3_cust_4 1
set_instance_parameter_value tes_cdc_0 format_3_cust_5 1
set_instance_parameter_value tes_cdc_0 format_3_cust_6 1
set_instance_parameter_value tes_cdc_0 format_3_cust_7 1
set_instance_parameter_value tes_cdc_0 format_3_cust_8 1
set_instance_parameter_value tes_cdc_0 format_3_cust_9 1
set_instance_parameter_value tes_cdc_0 format_4_cust_1 0
set_instance_parameter_value tes_cdc_0 format_4_cust_10 1
set_instance_parameter_value tes_cdc_0 format_4_cust_2 1
set_instance_parameter_value tes_cdc_0 format_4_cust_3 1
set_instance_parameter_value tes_cdc_0 format_4_cust_4 1
set_instance_parameter_value tes_cdc_0 format_4_cust_5 1
set_instance_parameter_value tes_cdc_0 format_4_cust_6 1
set_instance_parameter_value tes_cdc_0 format_4_cust_7 1
set_instance_parameter_value tes_cdc_0 format_4_cust_8 1
set_instance_parameter_value tes_cdc_0 format_4_cust_9 1
set_instance_parameter_value tes_cdc_0 format_5_cust_1 0
set_instance_parameter_value tes_cdc_0 format_5_cust_10 1
set_instance_parameter_value tes_cdc_0 format_5_cust_2 1
set_instance_parameter_value tes_cdc_0 format_5_cust_3 1
set_instance_parameter_value tes_cdc_0 format_5_cust_4 1
set_instance_parameter_value tes_cdc_0 format_5_cust_5 1
set_instance_parameter_value tes_cdc_0 format_5_cust_6 1
set_instance_parameter_value tes_cdc_0 format_5_cust_7 1
set_instance_parameter_value tes_cdc_0 format_5_cust_8 1
set_instance_parameter_value tes_cdc_0 format_5_cust_9 1
set_instance_parameter_value tes_cdc_0 format_6_cust_1 0
set_instance_parameter_value tes_cdc_0 format_6_cust_10 1
set_instance_parameter_value tes_cdc_0 format_6_cust_2 1
set_instance_parameter_value tes_cdc_0 format_6_cust_3 1
set_instance_parameter_value tes_cdc_0 format_6_cust_4 1
set_instance_parameter_value tes_cdc_0 format_6_cust_5 1
set_instance_parameter_value tes_cdc_0 format_6_cust_6 1
set_instance_parameter_value tes_cdc_0 format_6_cust_7 1
set_instance_parameter_value tes_cdc_0 format_6_cust_8 1
set_instance_parameter_value tes_cdc_0 format_6_cust_9 1
set_instance_parameter_value tes_cdc_0 format_7_cust_1 0
set_instance_parameter_value tes_cdc_0 format_7_cust_10 1
set_instance_parameter_value tes_cdc_0 format_7_cust_2 1
set_instance_parameter_value tes_cdc_0 format_7_cust_3 1
set_instance_parameter_value tes_cdc_0 format_7_cust_4 1
set_instance_parameter_value tes_cdc_0 format_7_cust_5 1
set_instance_parameter_value tes_cdc_0 format_7_cust_6 1
set_instance_parameter_value tes_cdc_0 format_7_cust_7 1
set_instance_parameter_value tes_cdc_0 format_7_cust_8 1
set_instance_parameter_value tes_cdc_0 format_7_cust_9 1
set_instance_parameter_value tes_cdc_0 h_pos_start_cust_1 0
set_instance_parameter_value tes_cdc_0 h_pos_start_cust_10 0
set_instance_parameter_value tes_cdc_0 h_pos_start_cust_2 0
set_instance_parameter_value tes_cdc_0 h_pos_start_cust_3 0
set_instance_parameter_value tes_cdc_0 h_pos_start_cust_4 0
set_instance_parameter_value tes_cdc_0 h_pos_start_cust_5 0
set_instance_parameter_value tes_cdc_0 h_pos_start_cust_6 0
set_instance_parameter_value tes_cdc_0 h_pos_start_cust_7 0
set_instance_parameter_value tes_cdc_0 h_pos_start_cust_8 0
set_instance_parameter_value tes_cdc_0 h_pos_start_cust_9 0
set_instance_parameter_value tes_cdc_0 h_pos_stop_cust_1 0
set_instance_parameter_value tes_cdc_0 h_pos_stop_cust_10 0
set_instance_parameter_value tes_cdc_0 h_pos_stop_cust_2 0
set_instance_parameter_value tes_cdc_0 h_pos_stop_cust_3 0
set_instance_parameter_value tes_cdc_0 h_pos_stop_cust_4 0
set_instance_parameter_value tes_cdc_0 h_pos_stop_cust_5 0
set_instance_parameter_value tes_cdc_0 h_pos_stop_cust_6 0
set_instance_parameter_value tes_cdc_0 h_pos_stop_cust_7 0
set_instance_parameter_value tes_cdc_0 h_pos_stop_cust_8 0
set_instance_parameter_value tes_cdc_0 h_pos_stop_cust_9 0
set_instance_parameter_value tes_cdc_0 pixel_clock_freq 65000000
set_instance_parameter_value tes_cdc_0 pixel_format_cust_1 0
set_instance_parameter_value tes_cdc_0 pixel_format_cust_10 0
set_instance_parameter_value tes_cdc_0 pixel_format_cust_2 0
set_instance_parameter_value tes_cdc_0 pixel_format_cust_3 0
set_instance_parameter_value tes_cdc_0 pixel_format_cust_4 0
set_instance_parameter_value tes_cdc_0 pixel_format_cust_5 0
set_instance_parameter_value tes_cdc_0 pixel_format_cust_6 0
set_instance_parameter_value tes_cdc_0 pixel_format_cust_7 0
set_instance_parameter_value tes_cdc_0 pixel_format_cust_8 0
set_instance_parameter_value tes_cdc_0 pixel_format_cust_9 0
set_instance_parameter_value tes_cdc_0 rotation_disable false
set_instance_parameter_value tes_cdc_0 rotation_enable false
set_instance_parameter_value tes_cdc_0 scaler_ena_cust_1 true
set_instance_parameter_value tes_cdc_0 scaler_ena_cust_10 true
set_instance_parameter_value tes_cdc_0 scaler_ena_cust_2 true
set_instance_parameter_value tes_cdc_0 scaler_ena_cust_3 true
set_instance_parameter_value tes_cdc_0 scaler_ena_cust_4 true
set_instance_parameter_value tes_cdc_0 scaler_ena_cust_5 true
set_instance_parameter_value tes_cdc_0 scaler_ena_cust_6 true
set_instance_parameter_value tes_cdc_0 scaler_ena_cust_7 true
set_instance_parameter_value tes_cdc_0 scaler_ena_cust_8 true
set_instance_parameter_value tes_cdc_0 scaler_ena_cust_9 true
set_instance_parameter_value tes_cdc_0 v_pos_start_cust_1 0
set_instance_parameter_value tes_cdc_0 v_pos_start_cust_10 0
set_instance_parameter_value tes_cdc_0 v_pos_start_cust_2 0
set_instance_parameter_value tes_cdc_0 v_pos_start_cust_3 0
set_instance_parameter_value tes_cdc_0 v_pos_start_cust_4 0
set_instance_parameter_value tes_cdc_0 v_pos_start_cust_5 0
set_instance_parameter_value tes_cdc_0 v_pos_start_cust_6 0
set_instance_parameter_value tes_cdc_0 v_pos_start_cust_7 0
set_instance_parameter_value tes_cdc_0 v_pos_start_cust_8 0
set_instance_parameter_value tes_cdc_0 v_pos_start_cust_9 0
set_instance_parameter_value tes_cdc_0 v_pos_stop_cust_1 0
set_instance_parameter_value tes_cdc_0 v_pos_stop_cust_10 0
set_instance_parameter_value tes_cdc_0 v_pos_stop_cust_2 0
set_instance_parameter_value tes_cdc_0 v_pos_stop_cust_3 0
set_instance_parameter_value tes_cdc_0 v_pos_stop_cust_4 0
set_instance_parameter_value tes_cdc_0 v_pos_stop_cust_5 0
set_instance_parameter_value tes_cdc_0 v_pos_stop_cust_6 0
set_instance_parameter_value tes_cdc_0 v_pos_stop_cust_7 0
set_instance_parameter_value tes_cdc_0 v_pos_stop_cust_8 0
set_instance_parameter_value tes_cdc_0 v_pos_stop_cust_9 0
set_instance_parameter_value tes_cdc_0 windowing_ena_cust_1 true
set_instance_parameter_value tes_cdc_0 windowing_ena_cust_10 true
set_instance_parameter_value tes_cdc_0 windowing_ena_cust_2 true
set_instance_parameter_value tes_cdc_0 windowing_ena_cust_3 true
set_instance_parameter_value tes_cdc_0 windowing_ena_cust_4 true
set_instance_parameter_value tes_cdc_0 windowing_ena_cust_5 true
set_instance_parameter_value tes_cdc_0 windowing_ena_cust_6 true
set_instance_parameter_value tes_cdc_0 windowing_ena_cust_7 true
set_instance_parameter_value tes_cdc_0 windowing_ena_cust_8 true
set_instance_parameter_value tes_cdc_0 windowing_ena_cust_9 true
set_instance_parameter_value tes_cdc_0 ycbcr_420_fullyplanar_cust_1 false
set_instance_parameter_value tes_cdc_0 ycbcr_420_fullyplanar_cust_10 false
set_instance_parameter_value tes_cdc_0 ycbcr_420_fullyplanar_cust_2 false
set_instance_parameter_value tes_cdc_0 ycbcr_420_fullyplanar_cust_3 false
set_instance_parameter_value tes_cdc_0 ycbcr_420_fullyplanar_cust_4 false
set_instance_parameter_value tes_cdc_0 ycbcr_420_fullyplanar_cust_5 false
set_instance_parameter_value tes_cdc_0 ycbcr_420_fullyplanar_cust_6 false
set_instance_parameter_value tes_cdc_0 ycbcr_420_fullyplanar_cust_7 false
set_instance_parameter_value tes_cdc_0 ycbcr_420_fullyplanar_cust_8 false
set_instance_parameter_value tes_cdc_0 ycbcr_420_fullyplanar_cust_9 false
set_instance_parameter_value tes_cdc_0 ycbcr_420_semiplanar_cust_1 false
set_instance_parameter_value tes_cdc_0 ycbcr_420_semiplanar_cust_10 false
set_instance_parameter_value tes_cdc_0 ycbcr_420_semiplanar_cust_2 false
set_instance_parameter_value tes_cdc_0 ycbcr_420_semiplanar_cust_3 false
set_instance_parameter_value tes_cdc_0 ycbcr_420_semiplanar_cust_4 false
set_instance_parameter_value tes_cdc_0 ycbcr_420_semiplanar_cust_5 false
set_instance_parameter_value tes_cdc_0 ycbcr_420_semiplanar_cust_6 false
set_instance_parameter_value tes_cdc_0 ycbcr_420_semiplanar_cust_7 false
set_instance_parameter_value tes_cdc_0 ycbcr_420_semiplanar_cust_8 false
set_instance_parameter_value tes_cdc_0 ycbcr_420_semiplanar_cust_9 false
set_instance_parameter_value tes_cdc_0 ycbcr_422_interleaved_cust_1 false
set_instance_parameter_value tes_cdc_0 ycbcr_422_interleaved_cust_10 false
set_instance_parameter_value tes_cdc_0 ycbcr_422_interleaved_cust_2 false
set_instance_parameter_value tes_cdc_0 ycbcr_422_interleaved_cust_3 false
set_instance_parameter_value tes_cdc_0 ycbcr_422_interleaved_cust_4 false
set_instance_parameter_value tes_cdc_0 ycbcr_422_interleaved_cust_5 false
set_instance_parameter_value tes_cdc_0 ycbcr_422_interleaved_cust_6 false
set_instance_parameter_value tes_cdc_0 ycbcr_422_interleaved_cust_7 false
set_instance_parameter_value tes_cdc_0 ycbcr_422_interleaved_cust_8 false
set_instance_parameter_value tes_cdc_0 ycbcr_422_interleaved_cust_9 false
